# Altium project PC-104 8 bit bus.PrjPCB
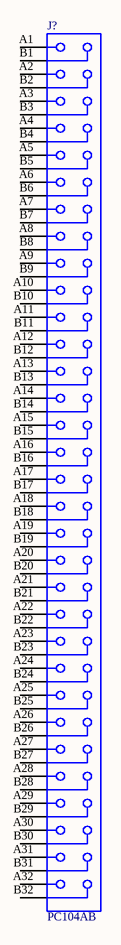
[diagram p0: PC-104 8 bit bus.schdoc]
1 sheet, 1 parts. Net scope: global (net labels, ports and power ports of the same name join across sheets).
Board file: PC-104 8 bit bus.PCBDOC

## Sheet PC-104 8 bit bus.schdoc: PC-104 8 bit bus
size B; Organization: Organization; Address1: Address1; Address2: Address2; Address3: Address3; Address4: Address4; DocumentNumber: 1; Revision: 0; SheetNumber: 2; SheetTotal: 2

### Parts
J?  PC104AB  [PC104AB]

### Nets

Not connected (* = marked no-connect by the designer): J? A1 A2 A3 A4 A5 A6 A7 A8 A9 A10 A11 A12 A13 A14 A15 A16 A17 A18 A19 A20 A21 A22 A23 A24 A25 A26 A27 A28 A29 A30 A31 A32 B1 B2 B3 B4 B5 B6 B7 B8 B9 B10 B11 B12 B13 B14 B15 B16 B17 B18 B19 B20 B21 B22 B23 B24 B25 B26 B27 B28 B29 B30 B31 B32

### Library data of the parts
J? = PC104AB: 64-Pin Connector; Text Field6: Alternate Layout Available; Text Field7: Published 14-Feb-2002